# EAGLE design M906A (EAGLE 6.6.0)
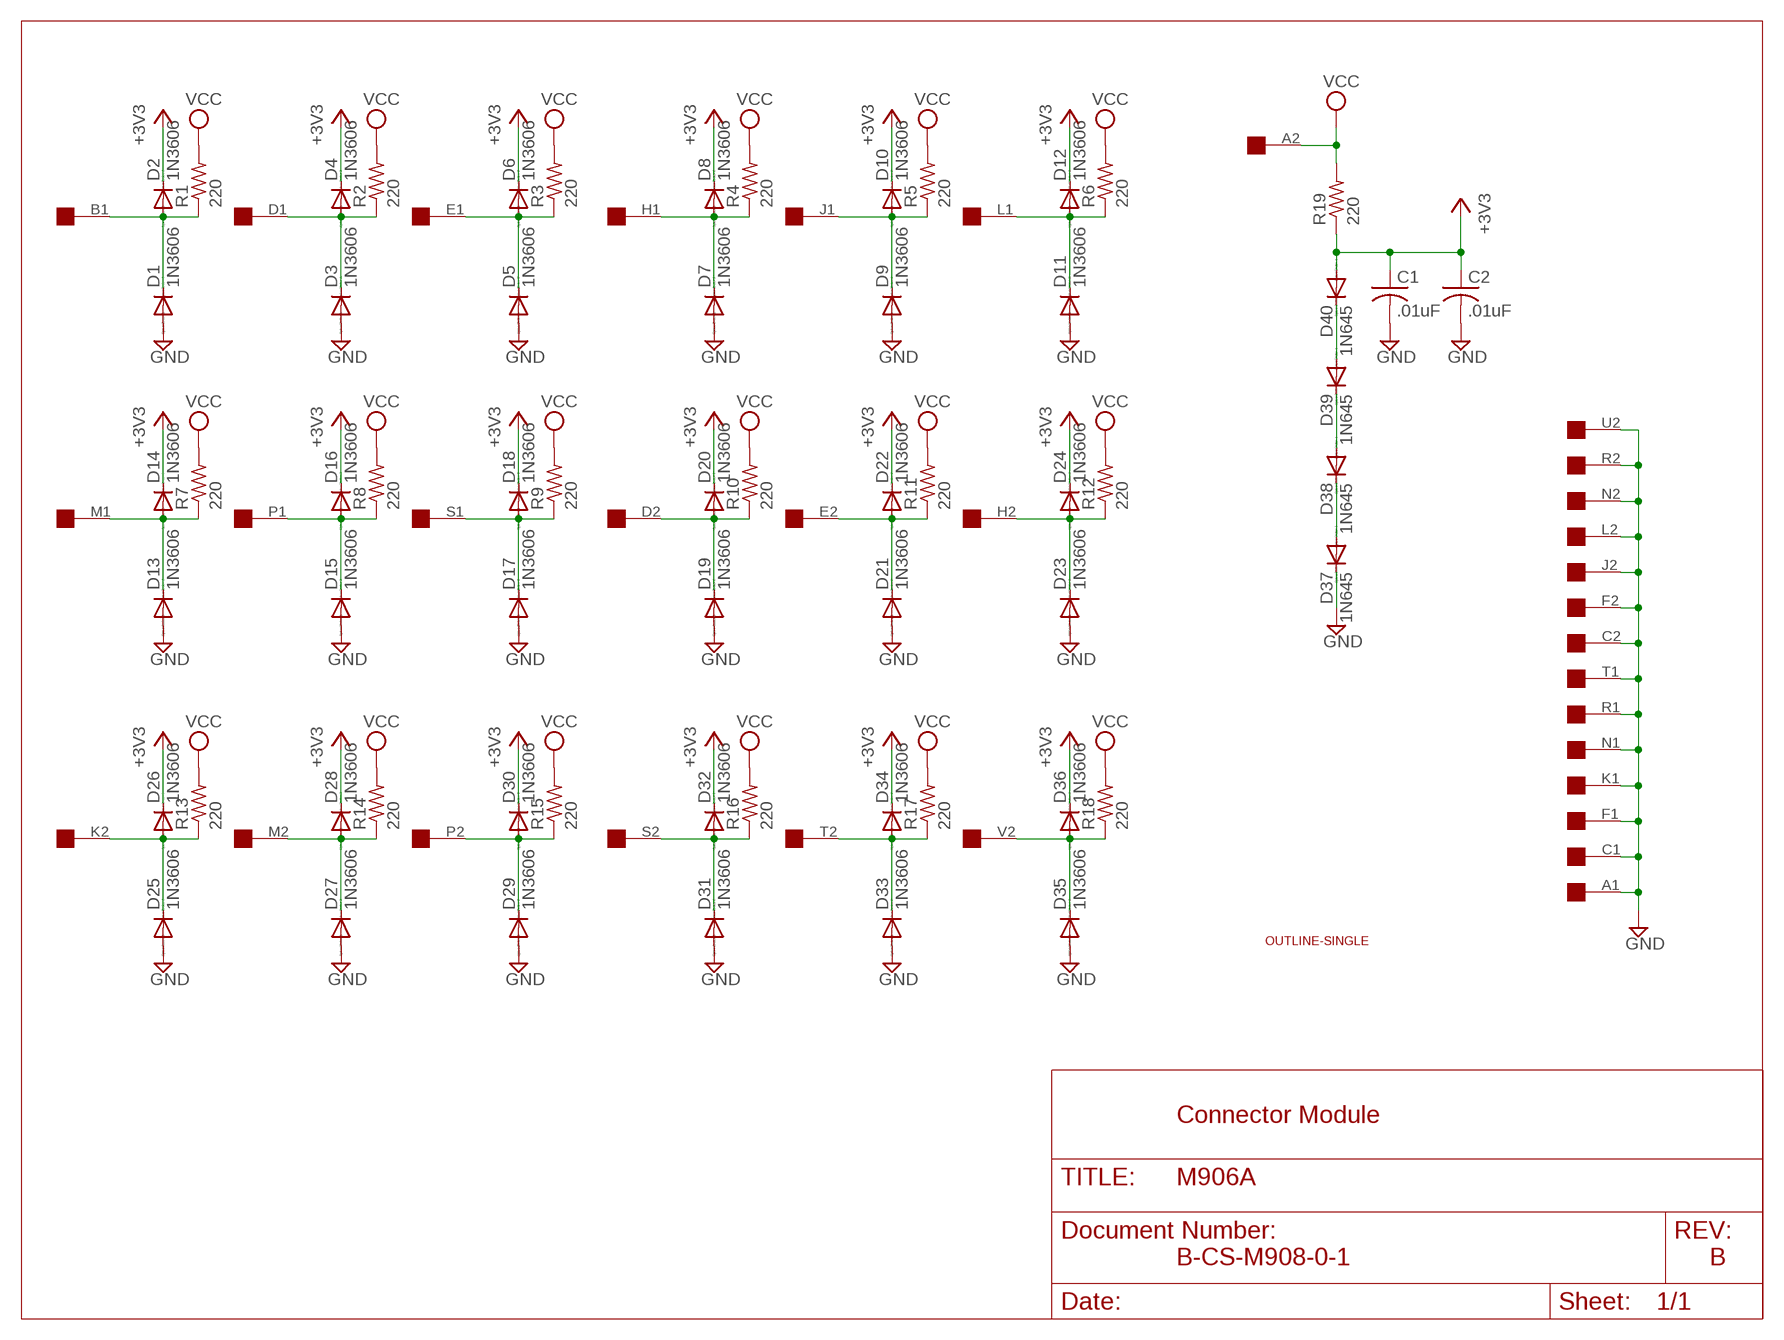
[diagram p0: schematic, sheet 1]

## Parts
C1  .01uF  C-US050-025X075  [C050-025X075]
C2  .01uF  C-US050-025X075  [C050-025X075]
D1  1N3606  1N4148DO35-10  [DO35-10]
D2  1N3606  1N4148DO35-10  [DO35-10]
D3  1N3606  1N4148DO35-10  [DO35-10]
D4  1N3606  1N4148DO35-10  [DO35-10]
D5  1N3606  1N4148DO35-10  [DO35-10]
D6  1N3606  1N4148DO35-10  [DO35-10]
D7  1N3606  1N4148DO35-10  [DO35-10]
D8  1N3606  1N4148DO35-10  [DO35-10]
D9  1N3606  1N4148DO35-10  [DO35-10]
D10  1N3606  1N4148DO35-10  [DO35-10]
D11  1N3606  1N4148DO35-10  [DO35-10]
D12  1N3606  1N4148DO35-10  [DO35-10]
D13  1N3606  1N4148DO35-10  [DO35-10]
D14  1N3606  1N4148DO35-10  [DO35-10]
D15  1N3606  1N4148DO35-10  [DO35-10]
D16  1N3606  1N4148DO35-10  [DO35-10]
D17  1N3606  1N4148DO35-10  [DO35-10]
D18  1N3606  1N4148DO35-10  [DO35-10]
D19  1N3606  1N4148DO35-10  [DO35-10]
D20  1N3606  1N4148DO35-10  [DO35-10]
D21  1N3606  1N4148DO35-10  [DO35-10]
D22  1N3606  1N4148DO35-10  [DO35-10]
D23  1N3606  1N4148DO35-10  [DO35-10]
D24  1N3606  1N4148DO35-10  [DO35-10]
D25  1N3606  1N4148DO35-10  [DO35-10]
D26  1N3606  1N4148DO35-10  [DO35-10]
D27  1N3606  1N4148DO35-10  [DO35-10]
D28  1N3606  1N4148DO35-10  [DO35-10]
D29  1N3606  1N4148DO35-10  [DO35-10]
D30  1N3606  1N4148DO35-10  [DO35-10]
D31  1N3606  1N4148DO35-10  [DO35-10]
D32  1N3606  1N4148DO35-10  [DO35-10]
D33  1N3606  1N4148DO35-10  [DO35-10]
D34  1N3606  1N4148DO35-10  [DO35-10]
D35  1N3606  1N4148DO35-10  [DO35-10]
D36  1N3606  1N4148DO35-10  [DO35-10]
D37  1N645  1N4148DO35-10  [DO35-10]
D38  1N645  1N4148DO35-10  [DO35-10]
D39  1N645  1N4148DO35-10  [DO35-10]
D40  1N645  1N4148DO35-10  [DO35-10]
R1  220  R-US_0207/10  [0207/10]
R2  220  R-US_0207/10  [0207/10]
R3  220  R-US_0207/10  [0207/10]
R4  220  R-US_0207/10  [0207/10]
R5  220  R-US_0207/10  [0207/10]
R6  220  R-US_0207/10  [0207/10]
R7  220  R-US_0207/10  [0207/10]
R8  220  R-US_0207/10  [0207/10]
R9  220  R-US_0207/10  [0207/10]
R10  220  R-US_0207/10  [0207/10]
R11  220  R-US_0207/10  [0207/10]
R12  220  R-US_0207/10  [0207/10]
R13  220  R-US_0207/10  [0207/10]
R14  220  R-US_0207/10  [0207/10]
R15  220  R-US_0207/10  [0207/10]
R16  220  R-US_0207/10  [0207/10]
R17  220  R-US_0207/10  [0207/10]
R18  220  R-US_0207/10  [0207/10]
R19  220  R-US_0207/10  [0207/10]
U$1  SINGLE  [EDGE-CON2]
U$2  OUTLINE-SINGLE  [SINGLE]

## Nets
+3V3: C1.1 C2.1 D2.C D4.C D6.C D8.C D10.C D12.C D14.C D16.C D18.C D20.C D22.C D24.C D26.C D28.C D30.C D32.C D34.C D36.C D40.A R19.1
GND: C1.2 C2.2 D1.A D3.A D5.A D7.A D9.A D11.A D13.A D15.A D17.A D19.A D21.A D23.A D25.A D27.A D29.A D31.A D33.A D35.A D37.C U$1.A1 U$1.C1 U$1.C2 U$1.F1 U$1.F2 U$1.J2 U$1.K1 U$1.L2 U$1.N1 U$1.N2 U$1.R1 U$1.R2 U$1.T1 U$1.U2
N$1: D1.C D2.A R1.1 U$1.B1
N$2: D37.A D38.C
N$3: D38.A D39.C
N$4: D3.C D4.A R2.1 U$1.D1
N$5: D39.A D40.C
N$6: D5.C D6.A R3.1 U$1.E1
N$7: D7.C D8.A R4.1 U$1.H1
N$8: D9.C D10.A R5.1 U$1.J1
N$9: D11.C D12.A R6.1 U$1.L1
N$10: D13.C D14.A R7.1 U$1.M1
N$11: D15.C D16.A R8.1 U$1.P1
N$12: D17.C D18.A R9.1 U$1.S1
N$13: D19.C D20.A R10.1 U$1.D2
N$14: D21.C D22.A R11.1 U$1.E2
N$15: D23.C D24.A R12.1 U$1.H2
N$16: D25.C D26.A R13.1 U$1.K2
N$17: D27.C D28.A R14.1 U$1.M2
N$18: D29.C D30.A R15.1 U$1.P2
N$19: D31.C D32.A R16.1 U$1.S2
N$20: D33.C D34.A R17.1 U$1.T2
N$21: D35.C D36.A R18.1 U$1.V2
VCC: R1.2 R2.2 R3.2 R4.2 R5.2 R6.2 R7.2 R8.2 R9.2 R10.2 R11.2 R12.2 R13.2 R14.2 R15.2 R16.2 R17.2 R18.2 R19.2 U$1.A2
Unconnected: U$1.B2 U$1.U1 U$1.V1

## Notes on the sheet
- Connector Module
- B-CS-M908-0-1 | B

## Library data of the parts
C1 C2 = rcl:C-US: CAPACITOR, American symbol
D1-D40 = diode:1N4148: DIODE high speed (Philips)
R1-R19 = rcl:R-US_: RESISTOR, American symbol
U$1 = dec-con:SINGLE: Single-Height DEC board
U$2 = dec-con:OUTLINE-*: Board outlines for DEC boards.

## Board
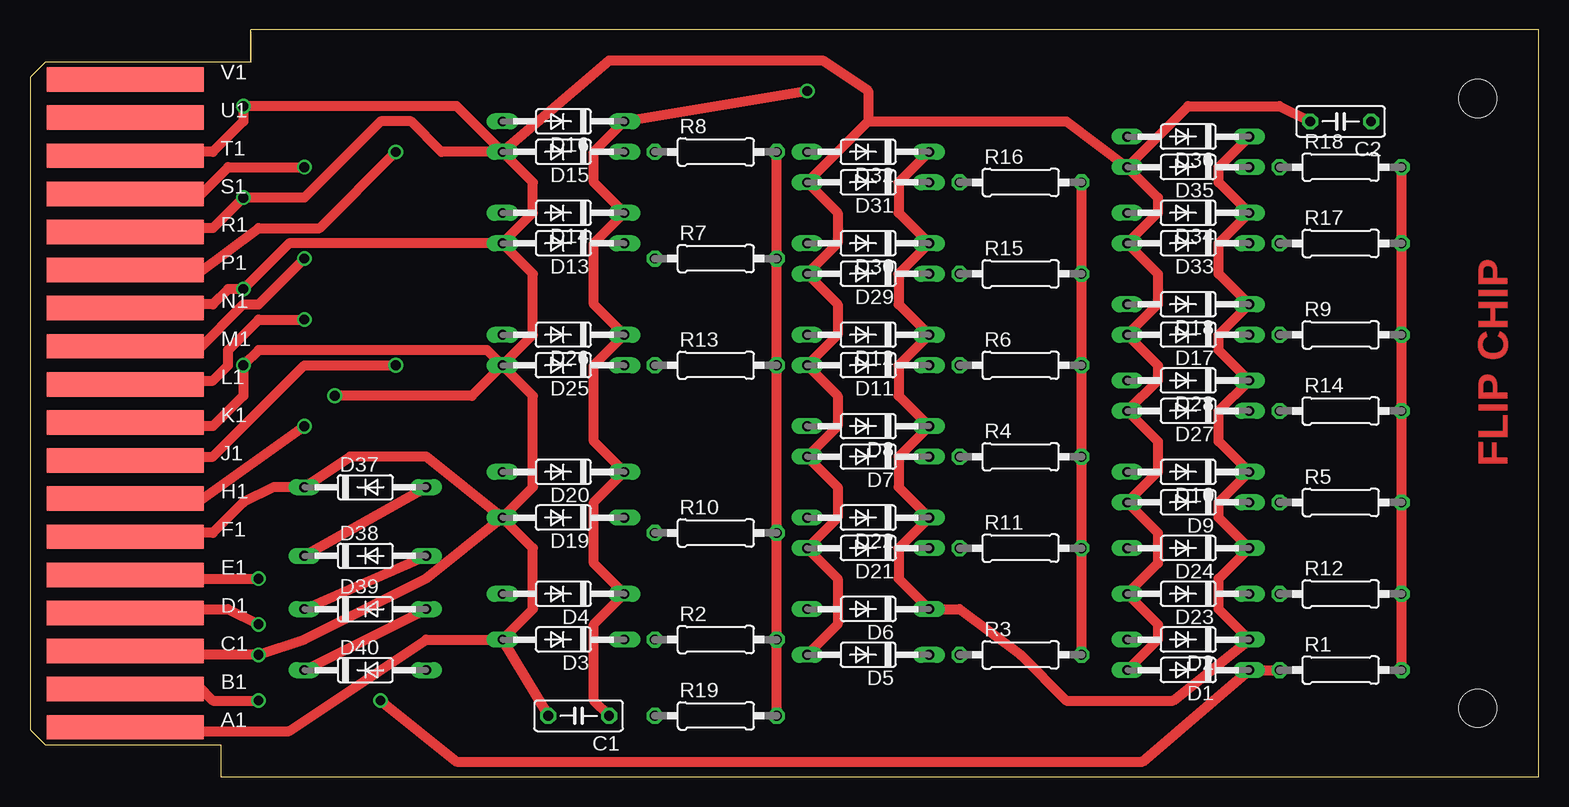
[diagram p1: board, top side]
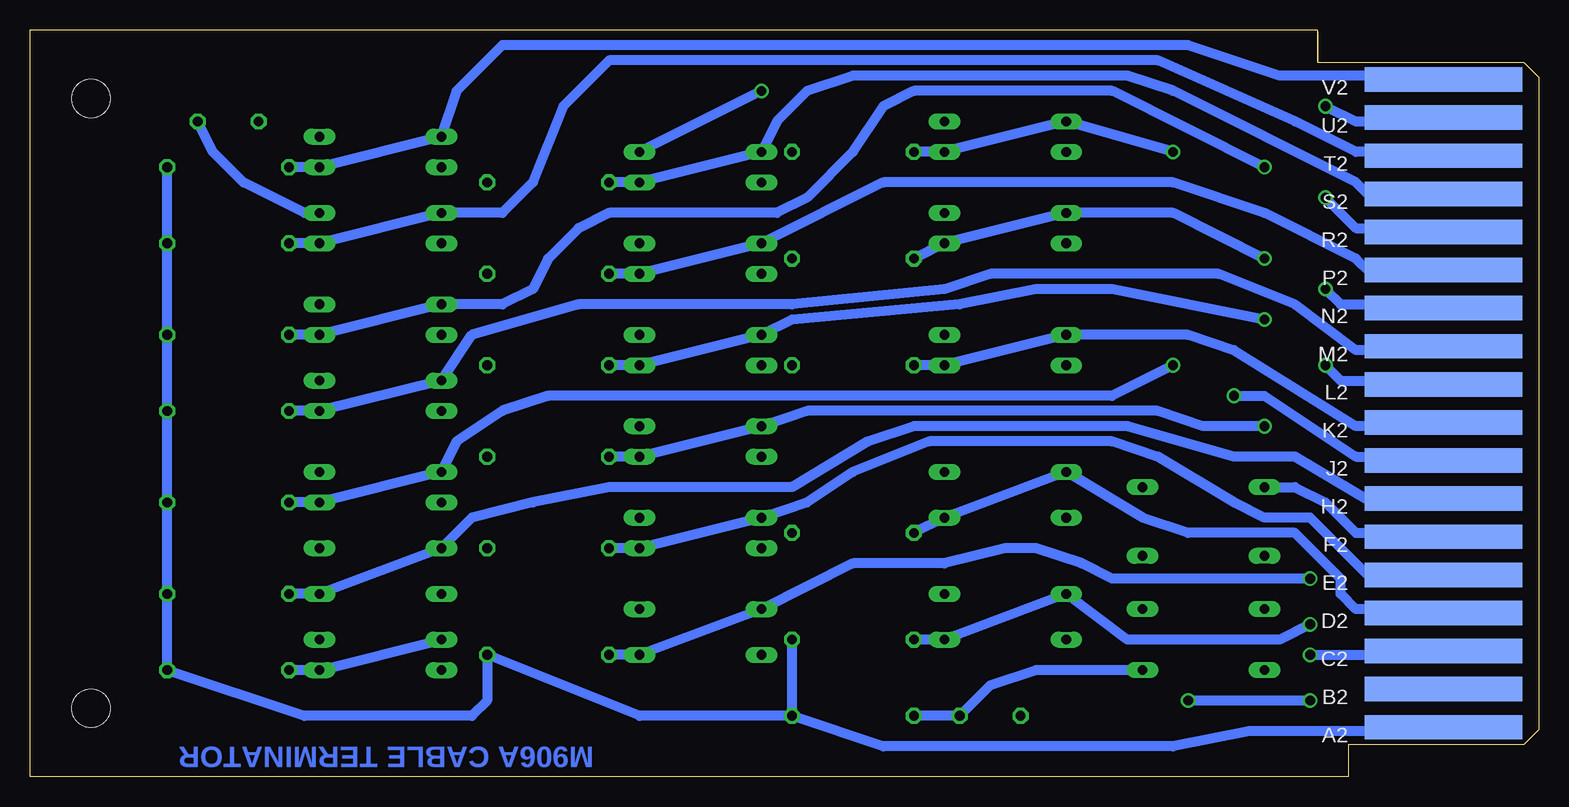
[diagram p2: board, bottom side, seen from below]

Size 125.73 x 62.23 mm. Coordinates in mm from the lower left corner, seen from the top.
Copper layers (1+16): Top 0.035mm / dielectric 1.5mm / Bottom 0.035mm
Design rules "16mils": minimum track width 16mil, minimum drill 32mil, track to track 15mil, track to pad 10mil, pad to pad 10mil, via to via 10mil, smd to smd 10mil, copper to edge 13mil, drill to drill 10mil, minimum pad ring 10mil, minimum via ring 8mil, stop-mask expansion 0mil, vias tented up to drill 0mil, thermal gap 10mil

### Footprints (pad centres in the part's own frame; a part is rotated, then mirrored left to right if it is on the bottom)
C050-025X075 = drill 0.813 octagon: 1 -2.54,0; 2 2.54,0
DO35-10 = drill 0.813 long: A 5.08,0; C -5.08,0
0207/10 = drill 0.813 octagon: 1 -5.08,0; 2 5.08,0
EDGE-CON2 = smd 13.106 x 2.032: A1 7.938,4.128; B1 7.938,7.303; C1 7.938,10.477; D1 7.938,13.652; E1 7.938,16.828; F1 7.938,20.003; H1 7.938,23.177; J1 7.938,26.352; K1 7.938,29.527; L1 7.938,32.703; M1 7.938,35.877; N1 7.938,39.053; P1 7.938,42.227; R1 7.938,45.403; S1 7.938,48.578; T1 7.938,51.752; U1 7.938,54.928; V1 7.938,58.102 | smd 13.106 x 2.032 bottom: A2 7.938,4.128; B2 7.938,7.303; C2 7.938,10.477; D2 7.938,13.652; E2 7.938,16.828; F2 7.938,20.003; H2 7.938,23.177; J2 7.938,26.352; K2 7.938,29.527; L2 7.938,32.703; M2 7.938,35.877; N2 7.938,39.053; P2 7.938,42.227; R2 7.938,45.403; S2 7.938,48.578; T2 7.938,51.752; U2 7.938,54.928; V2 7.938,58.102
SINGLE = hole 3.175: 120.65,56.515; 120.65,5.715

### Placement (x,y rotation side)
C1  45.72,5.08 180 top
C2  109.22,54.61 180 top
D1  96.52,8.89 180 top
D2  96.52,11.43 180 top
D3  44.45,11.43 180 top
D4  44.45,15.24 180 top
D5  69.85,10.16 180 top
D6  69.85,13.97 180 top
D7  69.85,26.67 180 top
D8  69.85,29.21 180 top
D9  96.52,22.86 180 top
D10  96.52,25.4 180 top
D11  69.85,34.29 180 top
D12  69.85,36.83 180 top
D13  44.45,44.45 180 top
D14  44.45,46.99 180 top
D15  44.45,52.07 180 top
D16  44.45,54.61 180 top
D17  96.52,36.83 180 top
D18  96.52,39.37 180 top
D19  44.45,21.59 180 top
D20  44.45,25.4 180 top
D21  69.85,19.05 180 top
D22  69.85,21.59 180 top
D23  96.52,15.24 180 top
D24  96.52,19.05 180 top
D25  44.45,34.29 180 top
D26  44.45,36.83 180 top
D27  96.52,30.48 180 top
D28  96.52,33.02 180 top
D29  69.85,41.91 180 top
D30  69.85,44.45 180 top
D31  69.85,49.53 180 top
D32  69.85,52.07 180 top
D33  96.52,44.45 180 top
D34  96.52,46.99 180 top
D35  96.52,50.8 180 top
D36  96.52,53.34 180 top
D37  27.94,24.13 0 top
D38  27.94,18.41 0 top
D39  27.94,13.97 0 top
D40  27.94,8.89 0 top
R1  109.22,8.89 0 top
R2  57.15,11.43 0 top
R3  82.55,10.16 0 top
R4  82.55,26.67 0 top
R5  109.22,22.86 0 top
R6  82.55,34.29 0 top
R7  57.15,43.18 0 top
R8  57.15,52.07 0 top
R9  109.22,36.83 0 top
R10  57.15,20.32 0 top
R11  82.55,19.05 0 top
R12  109.22,15.24 0 top
R13  57.15,34.29 0 top
R14  109.22,30.48 0 top
R15  82.55,41.91 0 top
R16  82.55,49.53 0 top
R17  109.22,44.45 0 top
R18  109.22,50.8 0 top
R19  57.15,5.08 0 top
U$1  0,0 0 top
U$2  0,0 0 top
U$3  [FLIPCHIP]  125.73,62.23 180 top

### Tracks (layer width: path | path; a pad name or v marks a point on that pad's centre or on a via)
+3V3  (via drill 0.81)
  Top 0.813: C1.1 46.99,6.35 46.99,12.7 D4.C 46.99,17.78 46.99,22.86 D20.C 46.99,27.94 46.99,34.29 D26.C 46.99,39.37 46.99,44.45 D14.C 46.99,49.53 46.99,52.07 D16.C v64.77,57.15 | D32.C 72.39,49.53 72.39,46.99 D30.C 72.39,41.91 72.39,39.37 D12.C 72.39,34.29 72.39,31.75 D8.C 72.39,26.67 72.39,24.13 D22.C 72.39,19.05 72.39,16.51 D6.C 77.47,13.97 82.55,10.16 86.36,6.35 95.25,6.35 D2.C 99.06,13.97 99.06,16.51 D24.C 99.06,21.59 99.06,22.86 D10.C 99.06,27.94 99.06,30.48 D28.C 99.06,35.56 99.06,36.83 D18.C 99.06,41.91 99.06,44.45 D34.C 99.06,49.53 99.06,50.8 D36.C
  Bottom 0.813: D40.A 41.91,8.89 45.72,7.62 C1.1 R19.1 | C2.1 110.49,52.07 107.95,49.53 102.87,46.99 D34.C | v64.77,57.15 D32.C
GND  (via drill 0.81)
  Top 0.813: U$1.C2 8.26,10.16 v19.05,10.16 22.86,11.43 33.02,16.51 D19.A | U$1.A1 8.26,3.81 21.59,3.81 33.02,11.43 D3.A | U$1.F2 8.26,20.32 15.24,20.32 17.78,22.86 20.32,24.13 D37.C 26.67,26.67 33.02,26.67 D19.A | U$1.T1 8.26,52.07 15.24,52.07 17.78,54.61 v17.78,55.88 35.56,55.88 D15.A | D3.A 41.91,13.97 41.91,19.05 D19.A | D25.A 41.91,31.75 41.91,24.13 D19.A | D25.A 38.1,35.56 19.05,35.56 v17.78,34.29 17.78,31.75 15.24,29.21 8.26,29.21 U$1.K1 | v25.4,31.75 36.83,31.75 D25.A | U$1.N2 8.26,39.37 15.24,39.37 16.51,40.64 v17.78,40.64 21.59,44.45 D13.A | U$1.R2 8.26,45.72 15.24,45.72 v17.78,48.26 22.86,48.26 29.21,54.61 31.75,54.61 34.29,52.07 D15.A | D15.A 41.91,49.53 41.91,46.99 D13.A | D13.A 41.91,41.91 41.91,36.83 D25.A | D3.A C1.2 | D5.A 67.31,12.7 67.31,16.51 D21.A 67.31,21.59 67.31,24.13 D7.A 67.31,29.21 67.31,31.75 D11.A 67.31,36.83 67.31,39.37 D29.A 67.31,44.45 67.31,46.99 D31.A 69.85,54.61 | D35.A 93.98,48.26 93.98,46.99 D33.A 93.98,41.91 93.98,39.37 D17.A 93.98,34.29 93.98,33.02 D27.A 93.98,27.94 93.98,25.4 D9.A 93.98,20.32 93.98,17.78 D23.A 93.98,12.7 93.98,11.43 D1.A | D15.A 48.26,59.69 66.04,59.69 69.85,57.15 69.85,54.61 | 69.85,54.61 86.36,54.61 D35.A | C2.2 104.14,55.88 96.52,55.88 D35.A
  Bottom 0.813: U$1.C2 8.26,10.16 v19.05,10.16 | U$1.F2 8.26,20.32 15.24,20.32 17.78,22.86 20.32,24.13 D37.C | U$1.J2 8.26,26.67 15.24,26.67 22.86,31.75 v25.4,31.75 | U$1.L2 8.26,33.02 16.51,33.02 v17.78,34.29 | U$1.N2 8.26,39.37 16.51,39.37 v17.78,40.64 | U$1.R2 8.26,45.72 15.24,45.72 v17.78,48.26 | U$1.U2 8.26,54.61 15.24,54.61 v17.78,55.88
N$1  (via drill 0.81)
  Top 0.813: U$1.B1 8.26,7.62 13.97,7.62 15.24,6.35 v19.05,6.35 | v29.21,6.35 35.56,1.27 92.71,1.27 D1.C R1.1
  Bottom 0.813: v19.05,6.35 v29.21,6.35 | D2.A D1.C R1.1
N$2
  Top 0.813: D38.C D37.A
N$3
  Top 0.813: D39.C D38.A
N$4  (via drill 0.81)
  Top 0.813: U$1.D1 8.26,13.97 16.51,13.97 v19.05,12.7
  Bottom 0.813: v19.05,12.7 21.59,11.43 34.29,11.43 D4.A D3.C R2.1
N$5
  Top 0.813: D40.C D39.A
N$6  (via drill 0.81)
  Top 0.813: U$1.E1 8.26,16.51 v19.05,16.51
  Bottom 0.813: v19.05,16.51 35.56,16.51 38.1,17.78 41.91,19.05 44.45,19.05 49.53,17.78 57.15,17.78 D6.A D5.C R3.1
N$7  (via drill 0.81)
  Top 0.813: U$1.H1 8.26,22.86 13.97,22.86 v22.86,29.21
  Bottom 0.813: v22.86,29.21 27.94,29.21 31.75,30.48 60.96,30.48 D8.A D7.C R4.1
N$8  (via drill 0.81)
  Top 0.813: U$1.J1 8.26,26.67 15.24,26.67 22.86,34.29 v30.48,34.29
  Bottom 0.813: v30.48,34.29 35.56,31.75 82.55,31.75 86.36,30.48 90.17,27.94 D10.A D9.C R5.1
N$9  (via drill 0.81)
  Top 0.813: U$1.L1 8.26,33.02 15.24,33.02 16.51,34.29 16.51,35.56 19.05,38.1 v22.86,38.1
  Bottom 0.813: v22.86,38.1 35.56,40.64 41.91,40.64 48.26,39.37 62.23,38.1 D12.A D11.C R6.1
N$10  (via drill 0.81)
  Top 0.813: U$1.M1 8.26,35.56 13.97,35.56 17.78,39.37 19.05,39.37 v22.86,43.18
  Bottom 0.813: v22.86,43.18 30.48,46.99 D14.A D13.C R7.1
N$11  (via drill 0.81)
  Top 0.813: U$1.P1 8.26,41.91 13.97,41.91 19.05,45.72 24.13,45.72 v30.48,52.07
  Bottom 0.813: v30.48,52.07 D16.A D15.C R8.1
N$12  (via drill 0.81)
  Top 0.813: U$1.S1 8.26,48.26 13.97,48.26 16.51,50.8 v22.86,50.8
  Bottom 0.813: v22.86,50.8 35.56,57.15 52.07,57.15 54.61,55.88 57.15,52.07 60.96,48.26 63.5,46.99 77.47,46.99 80.01,45.72 82.55,43.18 83.82,40.64 86.36,39.37 D18.A D17.C R9.1
N$13
  Bottom 0.813: U$1.D2 8.26,13.97 15.24,13.97 16.51,15.24 16.51,16.51 20.32,20.32 29.21,20.32 33.02,21.59 D20.A D19.C R10.1
N$14
  Bottom 0.813: U$1.E2 8.26,16.51 13.97,16.51 19.05,21.59 22.86,21.59 25.4,22.86 31.75,26.67 35.56,27.94 50.8,27.94 57.15,25.4 60.96,22.86 D22.A D21.C R11.1
N$15
  Bottom 0.813: U$1.H2 8.26,22.86 13.97,22.86 20.32,26.67 25.4,26.67 34.29,29.21 52.07,29.21 55.88,27.94 62.23,24.13 77.47,24.13 83.82,22.86 88.9,21.59 D24.A D23.C R12.1
N$16
  Bottom 0.813: U$1.K2 8.26,29.21 15.24,29.21 25.4,35.56 29.21,36.83 D26.A D25.C R13.1
N$17
  Bottom 0.813: U$1.M2 8.26,35.56 15.24,35.56 20.32,39.37 26.67,41.91 45.72,41.91 49.53,40.64 62.23,39.37 80.01,39.37 88.9,36.83 D28.A D27.C R14.1
N$18
  Bottom 0.813: U$1.P2 8.26,41.91 13.97,41.91 15.24,43.18 22.86,46.99 30.48,49.53 54.61,49.53 D30.A D29.C R15.1
N$19
  Bottom 0.813: U$1.S2 8.26,48.26 13.97,48.26 15.24,49.53 30.48,57.15 34.29,58.42 57.15,58.42 60.96,57.15 63.5,54.61 D32.A D31.C R16.1
N$20
  Bottom 0.813: U$1.T2 8.26,52.07 15.24,52.07 20.32,54.61 31.75,59.69 77.47,59.69 81.28,55.88 83.82,49.53 86.36,46.99 D34.A D33.C R17.1
N$21
  Bottom 0.813: U$1.V2 8.26,58.42 21.59,58.42 29.21,60.96 86.36,60.96 90.17,57.15 D36.A D35.C R18.1
VCC
  Top 0.813: R19.2 R2.2 R10.2 R13.2 R7.2 R8.2 | R16.2 R15.2 R6.2 R4.2 R11.2 R3.2 | R18.2 R17.2 R9.2 R14.2 R5.2 R12.2 R1.2
  Bottom 0.813: U$1.A2 8.26,3.81 24.13,3.81 30.48,2.54 54.61,2.54 R19.2 | R19.2 74.93,5.08 R3.2 87.63,6.35 88.9,5.08 102.87,5.08 R1.2 R12.2 R5.2 R14.2 R9.2 R17.2 R18.2 | R19.2 R2.2

### Text on the board
Bottom: M906A CABLE TERMINATOR